# EAGLE schematic ME461_F28027 (EAGLE 7.7.0)

## Sheet 1 of 5
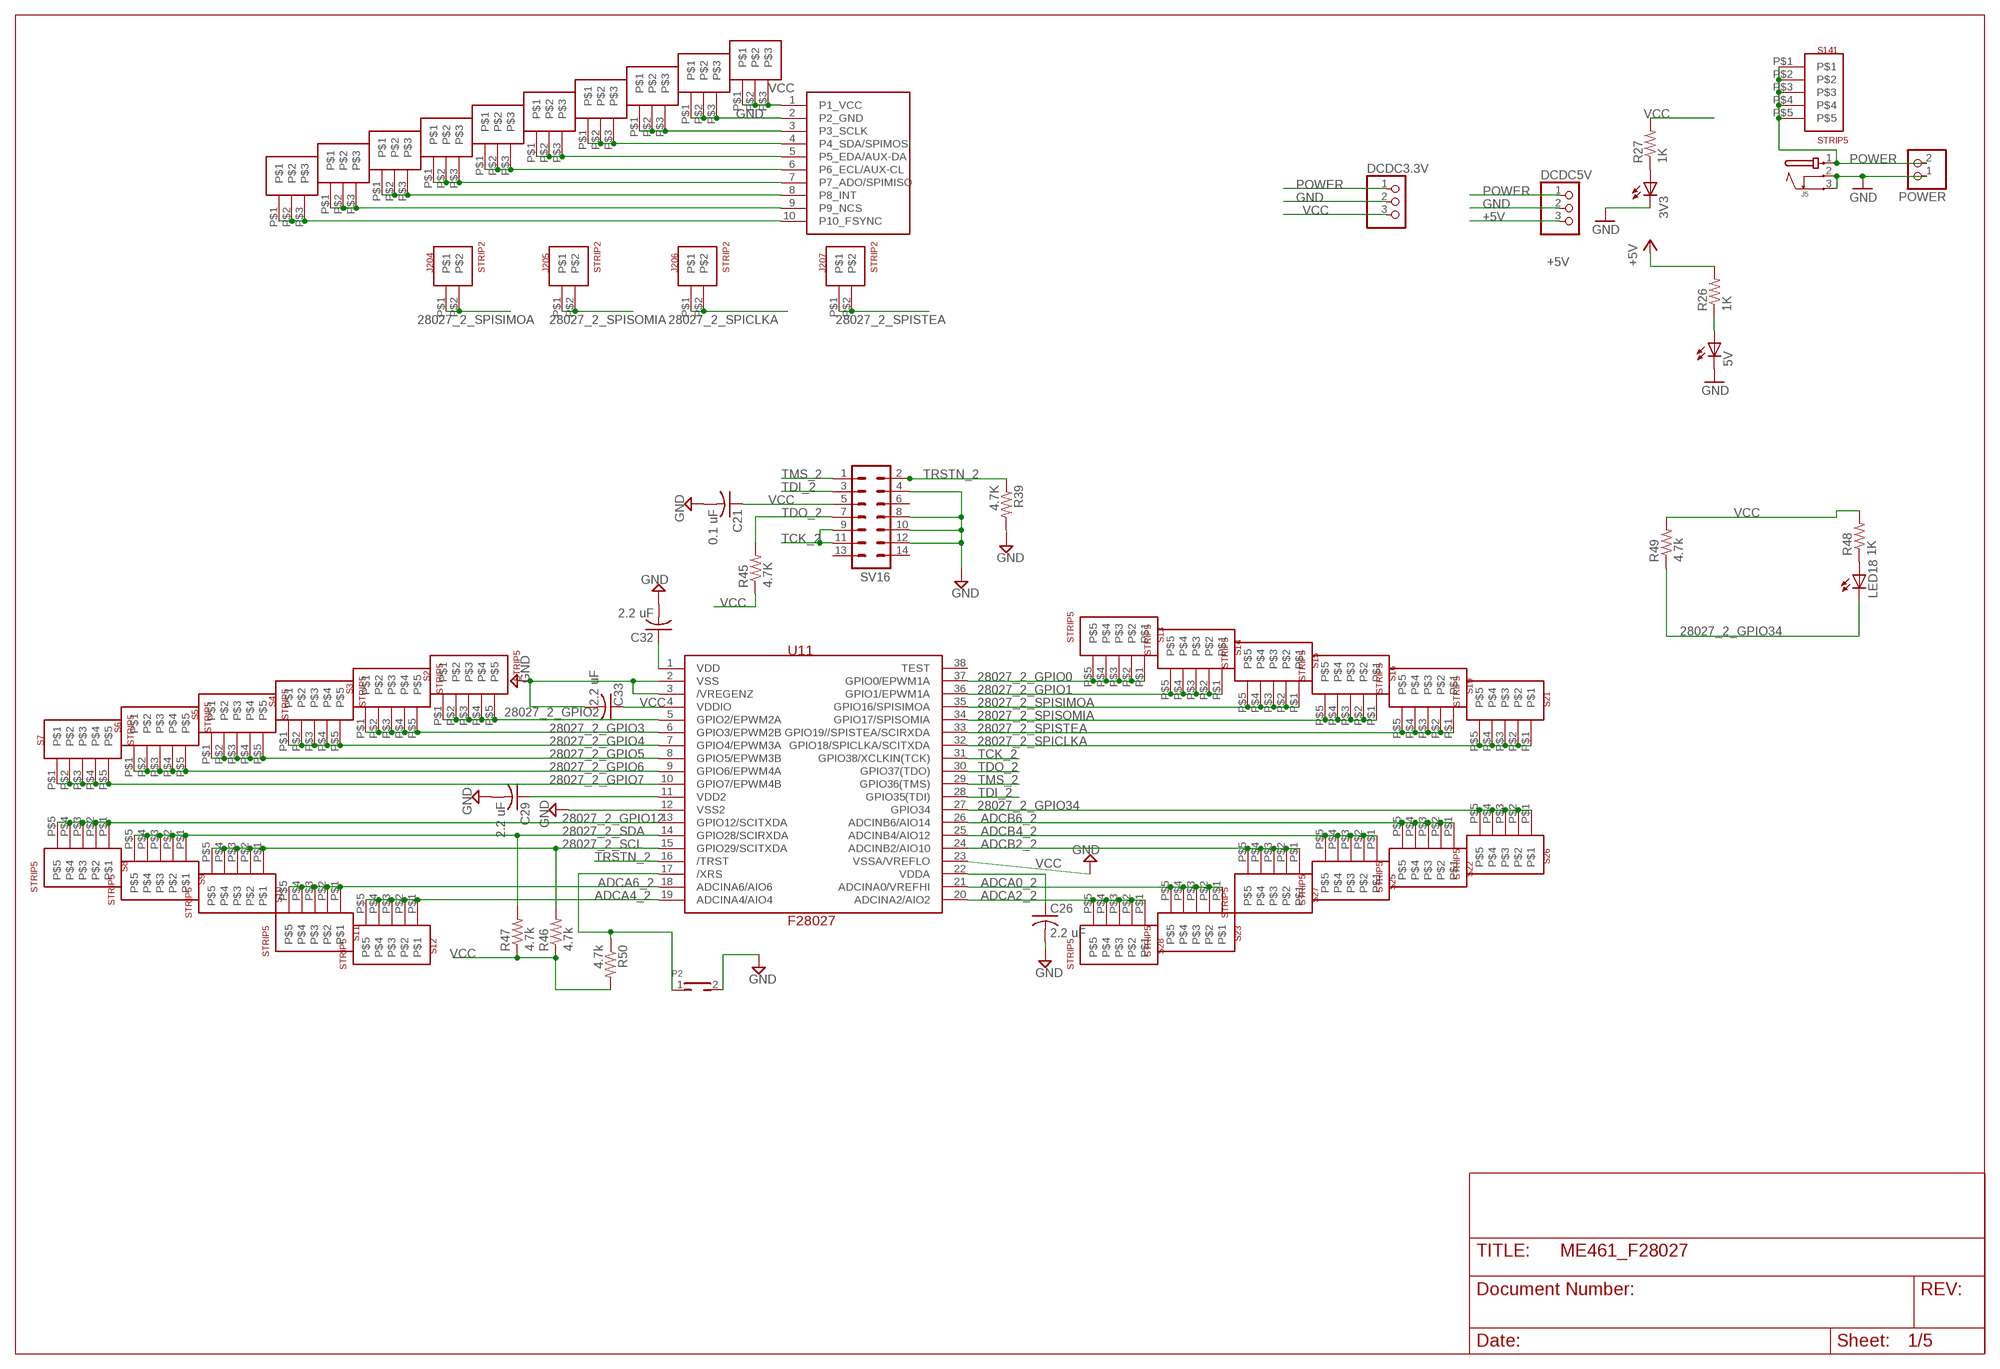
[diagram p0: schematic, sheet 1]

### Parts
3V3  LEDCHIPLED_1206  [CHIPLED_1206]
5V  LEDCHIPLED_1206  [CHIPLED_1206]
C21  0.1 uF  C-USC1206  [C1206]
C26  2.2 uF  C-USC1206  [C1206]
C29  2.2 uF  C-USC1206  [C1206]
C32  2.2 uF  C-USC1206  [C1206]
C33  2.2 uF  C-USC1206  [C1206]
DCDC3.3V  PINHD-1X3  [1X03]
DCDC5V  PINHD-1X3  [1X03]
J5  JACK-PMS  [JACK-PMS]
J123  STRIP3  [STRIP3]
J124  STRIP3  [STRIP3]
J125  STRIP3  [STRIP3]
J126  STRIP3  [STRIP3]
J127  STRIP3  [STRIP3]
J128  STRIP3  [STRIP3]
J129  STRIP3  [STRIP3]
J130  STRIP3  [STRIP3]
J131  STRIP3  [STRIP3]
J132  STRIP3  [STRIP3]
J204  STRIP2  [STRIP2]
J205  STRIP2  [STRIP2]
J206  STRIP2  [STRIP2]
J207  STRIP2  [STRIP2]
LED18  LEDCHIPLED_1206  [CHIPLED_1206]
P2  TH_PUSHBOTTON  [TH_PUSHBUTTON]
POWER  PINHD-1X2  [1X02]
R26  1K  R-US_M1206  [M1206]
R27  1K  R-US_M1206  [M1206]
R39  4.7K  R-US_M1206  [M1206]
R45  4.7K  R-US_M1206  [M1206]
R46  4.7k  R-US_M1206  [M1206]
R47  4.7k  R-US_M1206  [M1206]
R48  1K  R-US_M1206  [M1206]
R49  4.7k  R-US_M1206  [M1206]
R50  4.7k  R-US_M1206  [M1206]
S2  STRIP5  [STRIP5]
S3  STRIP5  [STRIP5]
S4  STRIP5  [STRIP5]
S5  STRIP5  [STRIP5]
S6  STRIP5  [STRIP5]
S7  STRIP5  [STRIP5]
S8  STRIP5  [STRIP5]
S9  STRIP5  [STRIP5]
S10  STRIP5  [STRIP5]
S11  STRIP5  [STRIP5]
S12  STRIP5  [STRIP5]
S13  STRIP5  [STRIP5]
S14  STRIP5  [STRIP5]
S15  STRIP5  [STRIP5]
S16  STRIP5  [STRIP5]
S19  STRIP5  [STRIP5]
S21  STRIP5  [STRIP5]
S22  STRIP5  [STRIP5]
S23  STRIP5  [STRIP5]
S25  STRIP5  [STRIP5]
S26  STRIP5  [STRIP5]
S27  STRIP5  [STRIP5]
S28  STRIP5  [STRIP5]
S141  STRIP5  [STRIP5]
SV16  MA07-2  [MA07-2]
U11  F28027  TMS320F28027DAS  [DA38]
U$1  MPU-9250-BB  [MPU-9250-BB]

### Nets
28027_2_GPIO0: S13.P$1 S13.P$2 S13.P$3 S13.P$4 S13.P$5 U11.37(GPIO0/EPWM1A) ; also sheet 3
28027_2_GPIO1: S14.P$1 S14.P$2 S14.P$3 S14.P$4 S14.P$5 U11.36(GPIO1/EPWM1A) ; also sheet 3
28027_2_GPIO2: S2.P$1 S2.P$2 S2.P$3 S2.P$4 S2.P$5 U11.5(GPIO2/EPWM2A) ; also sheet 3
28027_2_GPIO3: S3.P$1 S3.P$2 S3.P$3 S3.P$4 S3.P$5 U11.6(GPIO3/EPWM2B) ; also sheet 3
28027_2_GPIO4: S4.P$1 S4.P$2 S4.P$3 S4.P$4 S4.P$5 U11.7(GPIO4/EPWM3A) ; also sheet 3,4
28027_2_GPIO5: S5.P$1 S5.P$2 S5.P$3 S5.P$4 S5.P$5 U11.8(GPIO5/EPWM3B) ; also sheet 4
28027_2_GPIO6: S6.P$1 S6.P$2 S6.P$3 S6.P$4 S6.P$5 U11.9(GPIO6/EPWM4A) ; also sheet 3,4
28027_2_GPIO7: S7.P$1 S7.P$2 S7.P$3 S7.P$4 S7.P$5 U11.10(GPIO7/EPWM4B) ; also sheet 3
28027_2_GPIO12: S8.P$1 S8.P$2 S8.P$3 S8.P$4 S8.P$5 U11.13(GPIO12/SCITXDA) ; also sheet 3
28027_2_GPIO34: LED18.C R49.1 S26.P$1 S26.P$2 S26.P$3 S26.P$4 S26.P$5 U11.27(GPIO34) ; also sheet 4
28027_2_SCL: R46.2 S10.P$1 S10.P$2 S10.P$3 S10.P$4 S10.P$5 U11.15(GPIO29/SCITXDA) ; also sheet 4,5
28027_2_SDA: R47.2 S9.P$1 S9.P$2 S9.P$3 S9.P$4 S9.P$5 U11.14(GPIO28/SCIRXDA) ; also sheet 4,5
28027_2_SPICLKA: J206.P$1 J206.P$2 S21.P$1 S21.P$2 S21.P$3 S21.P$4 S21.P$5 U11.32(GPIO18/SPICLKA/SCITXDA) ; also sheet 2,4
28027_2_SPISIMOA: J204.P$1 J204.P$2 S15.P$1 S15.P$2 S15.P$3 S15.P$4 S15.P$5 U11.35(GPIO16/SPISIMOA) ; also sheet 2,4
28027_2_SPISOMIA: J205.P$1 J205.P$2 S16.P$1 S16.P$2 S16.P$3 S16.P$4 S16.P$5 U11.34(GPIO17/SPISOMIA) ; also sheet 2,4
28027_2_SPISTEA: J207.P$1 J207.P$2 S19.P$1 S19.P$2 S19.P$3 S19.P$4 S19.P$5 U11.33(GPIO19//SPISTEA/SCIRXDA)
+5V [supply]: DCDC5V.3 R26.2 ; also sheet 2,3,4,5
ADCA0_2: S23.P$1 S23.P$2 S23.P$3 S23.P$4 S23.P$5 U11.21(ADCINA0/VREFHI) ; also sheet 5
ADCA2_2: S28.P$1 S28.P$2 S28.P$3 S28.P$4 S28.P$5 U11.20(ADCINA2/AIO2) ; also sheet 5
ADCA4_2: S12.P$1 S12.P$2 S12.P$3 S12.P$4 S12.P$5 U11.19(ADCINA4/AIO4) ; also sheet 5
ADCA6_2: S11.P$1 S11.P$2 S11.P$3 S11.P$4 S11.P$5 U11.18(ADCINA6/AIO6) ; also sheet 5
ADCB2_2: S27.P$1 S27.P$2 S27.P$3 S27.P$4 S27.P$5 U11.24(ADCINB2/AIO10) ; also sheet 5
ADCB4_2: S25.P$1 S25.P$2 S25.P$3 S25.P$4 S25.P$5 U11.25(ADCINB4/AIO12) ; also sheet 4,5
ADCB6_2: S22.P$1 S22.P$2 S22.P$3 S22.P$4 S22.P$5 U11.26(ADCINB6/AIO14) ; also sheet 4
GND [supply]: 3V3.C 5V.C C21.2 C26.2 C29.2 C32.2 C33.2 DCDC3.3V.2 DCDC5V.2 J5.2 J5.3 J124.P$1 J124.P$2 J124.P$3 P2.2 POWER.1 R39.2 SV16.4 SV16.8 SV16.10 SV16.12 U11.2(VSS) U11.3(/VREGENZ) U11.12(VSS2) U11.23(VSSA/VREFLO) U$1.2(P2_GND) ; also sheet 2,3,4,5
N$2: 3V3.A R27.1
N$19: C32.1 U11.1(VDD)
N$20: C29.1 U11.11(VDD2)
N$21: P2.1 R50.1 U11.17(/XRS)
N$22: LED18.A R48.1
N$114: 5V.A R26.1
N$335 [supply]: J125.P$1 J125.P$2 J125.P$3 U$1.3(P3_SCLK)
N$336 [supply]: J126.P$1 J126.P$2 J126.P$3 U$1.4(P4_SDA/SPIMOSI)
N$337 [supply]: J127.P$1 J127.P$2 J127.P$3 U$1.5(P5_EDA/AUX-DA)
N$338 [supply]: J128.P$1 J128.P$2 J128.P$3 U$1.6(P6_ECL/AUX-CL)
N$339 [supply]: J129.P$1 J129.P$2 J129.P$3 U$1.7(P7_ADO/SPIMISO)
N$340 [supply]: J130.P$1 J130.P$2 J130.P$3 U$1.8(P8_INT)
N$341 [supply]: J131.P$1 J131.P$2 J131.P$3 U$1.9(P9_NCS)
N$342 [supply]: J132.P$1 J132.P$2 J132.P$3 U$1.10(P10_FSYNC)
POWER [supply]: DCDC3.3V.1 DCDC5V.1 J5.1 POWER.2 S141.P$1 S141.P$2 S141.P$3 S141.P$4 S141.P$5 ; also sheet 3,5
TCK_2: SV16.9 SV16.11 U11.31(GPIO38/XCLKIN(TCK))
TDI_2: SV16.3 U11.28(GPIO35(TDI))
TDO_2: R45.2 SV16.7 U11.30(GPIO37(TDO)) ; also sheet 5
TMS_2: SV16.1 U11.29(GPIO36(TMS))
TRSTN_2: R39.1 SV16.2 U11.16(/TRST)
VCC [supply]: C21.1 C26.1 C33.1 DCDC3.3V.3 J123.P$1 J123.P$2 J123.P$3 R27.2 R45.1 R46.1 R47.1 R48.2 R49.2 R50.2 SV16.5 U11.4(VDDIO) U11.22(VDDA) U$1.1(P1_VCC) ; also sheet 2,3,4,5
Unconnected: SV16.6 SV16.13 SV16.14 U11.38(TEST)

## Sheet 2 of 5
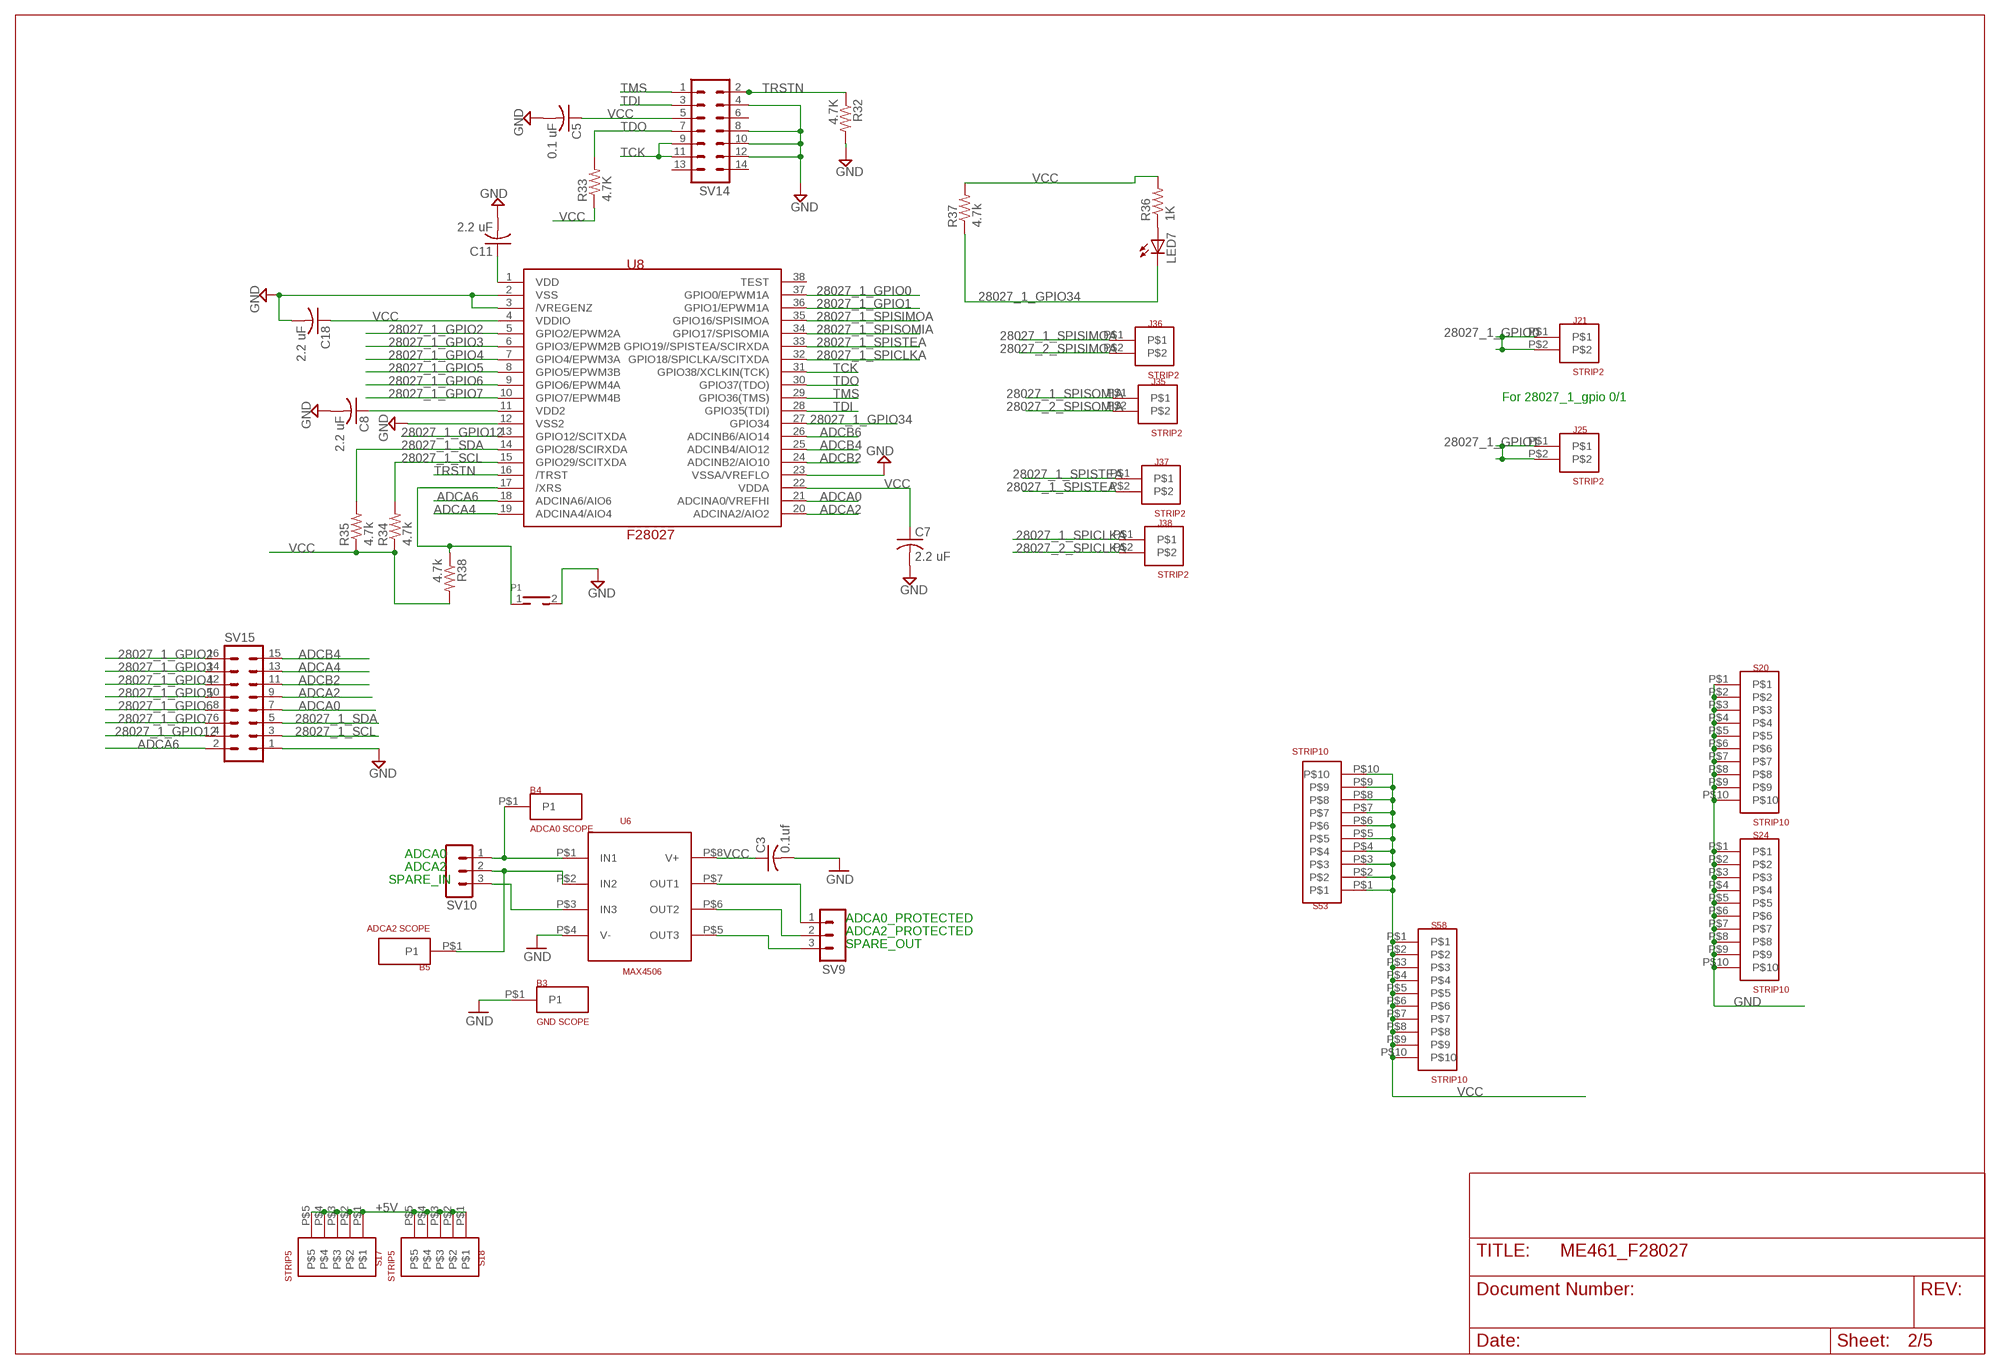
[diagram p1: schematic, sheet 2]

### Parts
B3  GND SCOPE  BANANA_MALE  [BANANA_MALE]
B4  ADCA0 SCOPE  BANANA_MALE  [BANANA_MALE]
B5  ADCA2 SCOPE  BANANA_MALE  [BANANA_MALE]
C3  0.1uf  C-USC1206  [C1206]
C5  0.1 uF  C-USC1206  [C1206]
C7  2.2 uF  C-USC1206  [C1206]
C8  2.2 uF  C-USC1206  [C1206]
C11  2.2 uF  C-USC1206  [C1206]
C18  2.2 uF  C-USC1206  [C1206]
J21  STRIP2  [STRIP2]
J25  STRIP2  [STRIP2]
J35  STRIP2  [STRIP2]
J36  STRIP2  [STRIP2]
J37  STRIP2  [STRIP2]
J38  STRIP2  [STRIP2]
LED7  LEDCHIPLED_1206  [CHIPLED_1206]
P1  TH_PUSHBOTTON  [TH_PUSHBUTTON]
R32  4.7K  R-US_M1206  [M1206]
R33  4.7K  R-US_M1206  [M1206]
R34  4.7k  R-US_M1206  [M1206]
R35  4.7k  R-US_M1206  [M1206]
R36  1K  R-US_M1206  [M1206]
R37  4.7k  R-US_M1206  [M1206]
R38  4.7k  R-US_M1206  [M1206]
S17  STRIP5  [STRIP5]
S18  STRIP5  [STRIP5]
S20  STRIP10  [STRIP10]
S24  STRIP10  [STRIP10]
S53  STRIP10  [STRIP10]
S58  STRIP10  [STRIP10]
SV9  MA03-1  [MA03-1]
SV10  MA03-1  [MA03-1]
SV14  MA07-2  [MA07-2]
SV15  MA08-2  [MA08-2]
U6  MAX4506  MAX4506-SOIC8  [SOIC-8]
U8  F28027  TMS320F28027DAS  [DA38]

### Nets
28027_1_GPIO0: J21.P$1 J21.P$2 U8.37(GPIO0/EPWM1A)
28027_1_GPIO1: J25.P$1 J25.P$2 U8.36(GPIO1/EPWM1A)
28027_1_GPIO2: SV15.16 U8.5(GPIO2/EPWM2A)
28027_1_GPIO3: SV15.14 U8.6(GPIO3/EPWM2B)
28027_1_GPIO4: SV15.12 U8.7(GPIO4/EPWM3A)
28027_1_GPIO5: SV15.10 U8.8(GPIO5/EPWM3B)
28027_1_GPIO6: SV15.8 U8.9(GPIO6/EPWM4A)
28027_1_GPIO7: SV15.6 U8.10(GPIO7/EPWM4B)
28027_1_GPIO12: SV15.4 U8.13(GPIO12/SCITXDA)
28027_1_GPIO34: LED7.C R37.1 U8.27(GPIO34)
28027_1_SCL: R34.2 SV15.3 U8.15(GPIO29/SCITXDA)
28027_1_SDA: R35.2 SV15.5 U8.14(GPIO28/SCIRXDA)
28027_1_SPICLKA: J38.P$1 U8.32(GPIO18/SPICLKA/SCITXDA)
28027_1_SPISIMOA: J36.P$1 U8.35(GPIO16/SPISIMOA)
28027_1_SPISOMIA: J35.P$1 U8.34(GPIO17/SPISOMIA)
28027_1_SPISTEA: J37.P$1 J37.P$2 U8.33(GPIO19//SPISTEA/SCIRXDA)
28027_2_SPICLKA: J38.P$2 ; also sheet 1,4
28027_2_SPISIMOA: J36.P$2 ; also sheet 1,4
28027_2_SPISOMIA: J35.P$2 ; also sheet 1,4
+5V [supply]: S17.P$1 S17.P$2 S17.P$3 S17.P$4 S17.P$5 S18.P$1 S18.P$2 S18.P$3 S18.P$4 S18.P$5 ; also sheet 1,3,4,5
ADCA0: SV15.7 U8.21(ADCINA0/VREFHI)
ADCA2: SV15.9 U8.20(ADCINA2/AIO2)
ADCA4: SV15.13 U8.19(ADCINA4/AIO4)
ADCA6: SV15.2 U8.18(ADCINA6/AIO6)
ADCB2: SV15.11 U8.24(ADCINB2/AIO10)
ADCB4: SV15.15 U8.25(ADCINB4/AIO12)
ADCB6: U8.26(ADCINB6/AIO14)
GND [supply]: B3.P$1(P1) C3.2 C5.2 C7.2 C8.2 C11.2 C18.2 P1.2 R32.2 S20.P$1 S20.P$2 S20.P$3 S20.P$4 S20.P$5 S20.P$6 S20.P$7 S20.P$8 S20.P$9 S20.P$10 S24.P$1 S24.P$2 S24.P$3 S24.P$4 S24.P$5 S24.P$6 S24.P$7 S24.P$8 S24.P$9 S24.P$10 SV14.4 SV14.8 SV14.10 SV14.12 SV15.1 U6.P$4(V-) U8.2(VSS) U8.3(/VREGENZ) U8.12(VSS2) U8.23(VSSA/VREFLO) ; also sheet 1,3,4,5
N$3: SV9.1 U6.P$7(OUT1)
N$4: SV9.2 U6.P$6(OUT2)
N$5: SV9.3 U6.P$5(OUT3)
N$6: B4.P$1(P1) SV10.1 U6.P$1(IN1)
N$8: SV10.3 U6.P$3(IN3)
N$14: C11.1 U8.1(VDD)
N$15: C8.1 U8.11(VDD2)
N$16: P1.1 R38.1 U8.17(/XRS)
N$18: LED7.A R36.1
N$26: B5.P$1(P1) SV10.2 U6.P$2(IN2)
TCK: SV14.9 SV14.11 U8.31(GPIO38/XCLKIN(TCK))
TDI: SV14.3 U8.28(GPIO35(TDI))
TDO: R33.2 SV14.7 U8.30(GPIO37(TDO))
TMS: SV14.1 U8.29(GPIO36(TMS))
TRSTN: R32.1 SV14.2 U8.16(/TRST)
VCC [supply]: C3.1 C5.1 C7.1 C18.1 R33.1 R34.1 R35.1 R36.2 R37.2 R38.2 S53.P$1 S53.P$2 S53.P$3 S53.P$4 S53.P$5 S53.P$6 S53.P$7 S53.P$8 S53.P$9 S53.P$10 S58.P$1 S58.P$2 S58.P$3 S58.P$4 S58.P$5 S58.P$6 S58.P$7 S58.P$8 S58.P$9 S58.P$10 SV14.5 U6.P$8(V+) U8.4(VDDIO) U8.22(VDDA) ; also sheet 1,3,4,5
Unconnected: SV14.6 SV14.13 SV14.14 U8.38(TEST)

### Notes on the sheet
- For 28027_1_gpio 0/1
- ADCA0
- ADCA2
- SPARE_IN
- ADCA0_PROTECTED
- ADCA2_PROTECTED
- SPARE_OUT

## Sheet 3 of 5
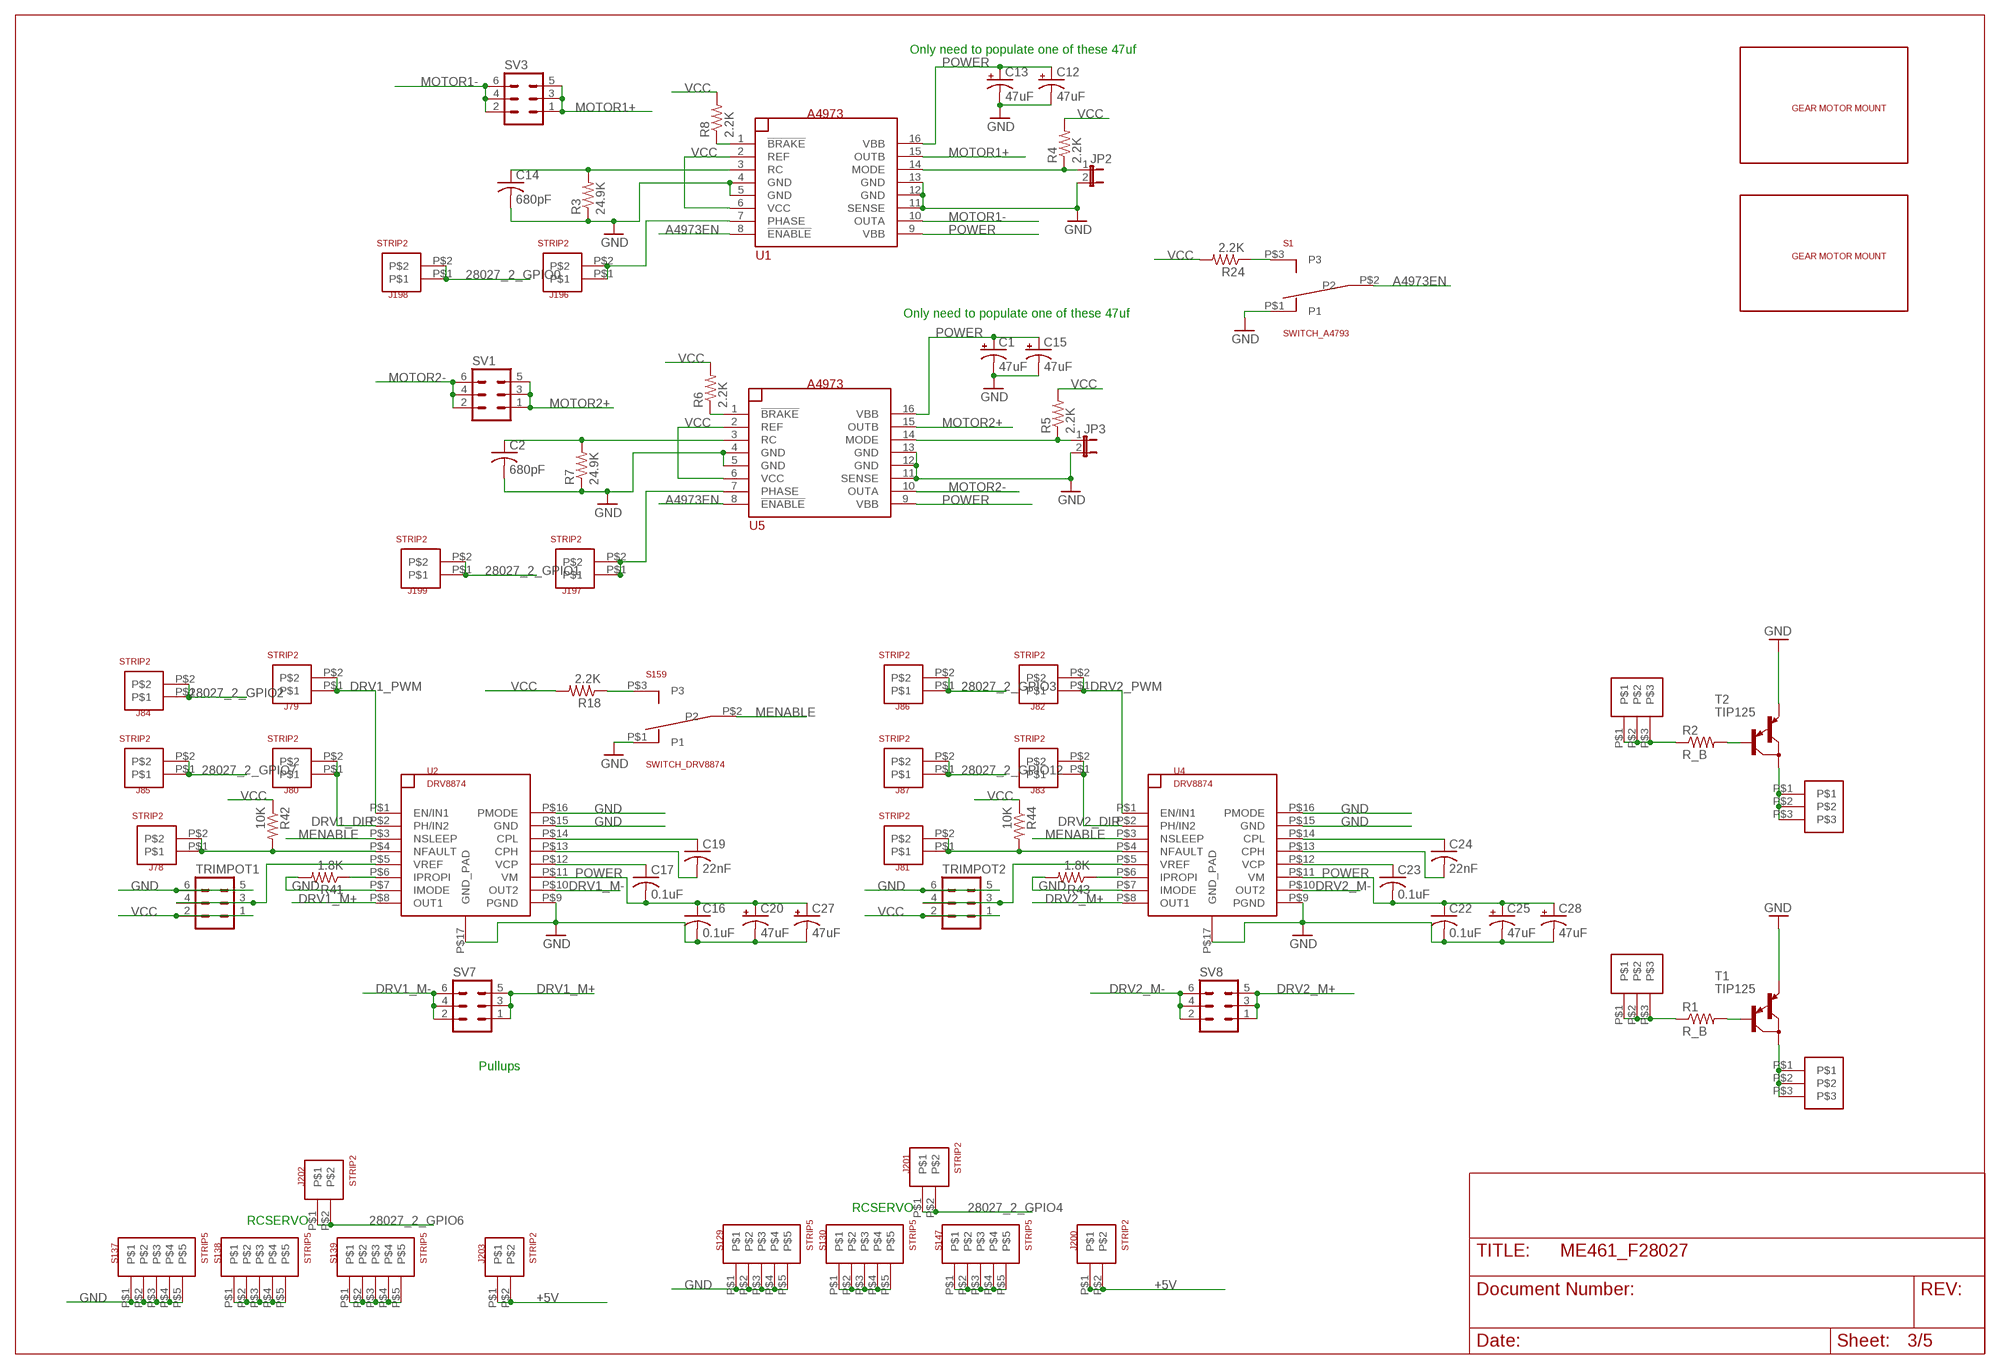
[diagram p2: schematic, sheet 3]

### Parts
C1  47uF  CPOL-US153CLV-0810  [153CLV-0810]
C2  680pF  C-USC1206  [C1206]
C12  47uF  CPOL-US153CLV-0810  [153CLV-0810]
C13  47uF  CPOL-US153CLV-0810  [153CLV-0810]
C14  680pF  C-USC1206  [C1206]
C15  47uF  CPOL-US153CLV-0810  [153CLV-0810]
C16  0.1uF  C-USC1206  [C1206]
C17  0.1uF  C-USC1206  [C1206]
C19  22nF  C-USC1206  [C1206]
C20  47uF  CPOL-US153CLV-0810  [153CLV-0810]
C22  0.1uF  C-USC1206  [C1206]
C23  0.1uF  C-USC1206  [C1206]
C24  22nF  C-USC1206  [C1206]
C25  47uF  CPOL-US153CLV-0810  [153CLV-0810]
C27  47uF  CPOL-US153CLV-0810  [153CLV-0810]
C28  47uF  CPOL-US153CLV-0810  [153CLV-0810]
J4  STRIP3  [STRIP3]
J6  STRIP3  [STRIP3]
J23  STRIP3  [STRIP3]
J24  STRIP3  [STRIP3]
J78  STRIP2  [STRIP2]
J79  STRIP2  [STRIP2]
J80  STRIP2  [STRIP2]
J81  STRIP2  [STRIP2]
J82  STRIP2  [STRIP2]
J83  STRIP2  [STRIP2]
J84  STRIP2  [STRIP2]
J85  STRIP2  [STRIP2]
J86  STRIP2  [STRIP2]
J87  STRIP2  [STRIP2]
J196  STRIP2  [STRIP2]
J197  STRIP2  [STRIP2]
J198  STRIP2  [STRIP2]
J199  STRIP2  [STRIP2]
J200  STRIP2  [STRIP2]
J201  STRIP2  [STRIP2]
J202  STRIP2  [STRIP2]
J203  STRIP2  [STRIP2]
JP2  JP1E  [JP1]
JP3  JP1E  [JP1]
R1  R_B  R-US_0207/10  [0207/10]
R2  R_B  R-US_0207/10  [0207/10]
R3  24.9K  R-US_M1206  [M1206]
R4  2.2K  R-US_M1206  [M1206]
R5  2.2K  R-US_M1206  [M1206]
R6  2.2K  R-US_M1206  [M1206]
R7  24.9K  R-US_M1206  [M1206]
R8  2.2K  R-US_M1206  [M1206]
R18  2.2K  R-US_M1206  [M1206]
R24  2.2K  R-US_M1206  [M1206]
R41  1.8K  R-US_M1206  [M1206]
R42  10K  R-US_M1206  [M1206]
R43  1.8K  R-US_M1206  [M1206]
R44  10K  R-US_M1206  [M1206]
S1  SWITCH_A4793  SWITCH_SLIDE  [SWITCH_SLIDE]
S129  STRIP5  [STRIP5]
S130  STRIP5  [STRIP5]
S137  STRIP5  [STRIP5]
S138  STRIP5  [STRIP5]
S139  STRIP5  [STRIP5]
S147  STRIP5  [STRIP5]
S159  SWITCH_DRV8874  SWITCH_SLIDE  [SWITCH_SLIDE]
SV1  MA03-2  [MA03-2]
SV3  MA03-2  [MA03-2]
SV7  MA03-2  [MA03-2]
SV8  MA03-2  [MA03-2]
T1  TIP125  [TO220]
T2  TIP125  [TO220]
TRIMPOT1  MA03-2  [MA03-2]
TRIMPOT2  MA03-2  [MA03-2]
U1  A4973  A3953  [SO16W]
U2  DRV8874  [HTSSOP16]
U4  DRV8874  [HTSSOP16]
U5  A4973  A3953  [SO16W]
U$2  GEARMOTOR_MOUNT  [GEARMOTOR_MOUNT]
U$3  GEARMOTOR_MOUNT  [GEARMOTOR_MOUNT]

### Nets
28027_2_GPIO0: J198.P$1 J198.P$2 ; also sheet 1
28027_2_GPIO1: J199.P$1 J199.P$2 ; also sheet 1
28027_2_GPIO2: J84.P$1 J84.P$2 ; also sheet 1
28027_2_GPIO3: J86.P$1 J86.P$2 ; also sheet 1
28027_2_GPIO4: J201.P$1 J201.P$2 ; also sheet 1,4
28027_2_GPIO6: J202.P$1 J202.P$2 ; also sheet 1,4
28027_2_GPIO7: J85.P$1 J85.P$2 ; also sheet 1
28027_2_GPIO12: J87.P$1 J87.P$2 ; also sheet 1
+5V [supply]: J200.P$1 J200.P$2 J203.P$1 J203.P$2 ; also sheet 1,2,4,5
A4973EN: S1.P$2(P2) U1.8(!ENABLE) U5.8(!ENABLE)
DRV1_DIR: J80.P$1 J80.P$2 U2.P$2(PH/IN2)
DRV1_M+: SV7.1 SV7.3 SV7.5 U2.P$8(OUT1)
DRV1_M-: SV7.2 SV7.4 SV7.6 U2.P$10(OUT2)
DRV1_PWM: J79.P$1 J79.P$2 U2.P$1(EN/IN1)
DRV2_DIR: J83.P$1 J83.P$2 U4.P$2(PH/IN2)
DRV2_M+: SV8.1 SV8.3 SV8.5 U4.P$8(OUT1)
DRV2_M-: SV8.2 SV8.4 SV8.6 U4.P$10(OUT2)
DRV2_PWM: J82.P$1 J82.P$2 U4.P$1(EN/IN1)
GND [supply]: C1.- C2.2 C12.- C13.- C14.2 C15.- C16.2 C20.- C22.2 C25.- C27.- C28.- JP2.2 JP3.2 R3.1 R7.1 R41.2 R43.2 S1.P$1(P1) S129.P$1 S129.P$2 S129.P$3 S129.P$4 S129.P$5 S137.P$1 S137.P$2 S137.P$3 S137.P$4 S137.P$5 S159.P$1(P1) T1.3(E) T2.3(E) TRIMPOT1.5 TRIMPOT1.6 TRIMPOT2.5 TRIMPOT2.6 U1.4(GND) U1.5(GND) U1.11(SENSE) U1.12(GND) U1.13(GND) U2.P$7(IMODE) U2.P$9(PGND) U2.P$15(GND) U2.P$16(PMODE) U2.P$17(GND_PAD) U4.P$7(IMODE) U4.P$9(PGND) U4.P$15(GND) U4.P$16(PMODE) U4.P$17(GND_PAD) U5.4(GND) U5.5(GND) U5.11(SENSE) U5.12(GND) U5.13(GND) ; also sheet 1,2,4,5
MENABLE: S159.P$2(P2) U2.P$3(NSLEEP) U4.P$3(NSLEEP)
MOTOR1+ [supply]: SV3.1 SV3.3 SV3.5 U1.15(OUTB)
MOTOR1- [supply]: SV3.2 SV3.4 SV3.6 U1.10(OUTA)
MOTOR2+ [supply]: SV1.1 SV1.3 SV1.5 U5.15(OUTB)
MOTOR2- [supply]: SV1.2 SV1.4 SV1.6 U5.10(OUTA)
N$1: R24.1 S1.P$3(P3)
N$9 [supply]: S139.P$1 S139.P$2 S139.P$3 S139.P$4 S139.P$5
N$10 [supply]: S147.P$1 S147.P$2 S147.P$3 S147.P$4 S147.P$5
N$31: R2.2 T2.1(B)
N$87: R1.2 T1.1(B)
N$88 [supply]: S138.P$1 S138.P$2 S138.P$3 S138.P$4 S138.P$5
N$125: R6.1 U5.1(!BRAKE)
N$127: C2.1 R7.2 U5.3(RC)
N$129: R8.1 U1.1(!BRAKE)
N$130: C14.1 R3.2 U1.3(RC)
N$131: JP2.1 R4.1 U1.14(MODE)
N$132: R18.1 S159.P$3(P3)
N$133: JP3.1 R5.1 U5.14(MODE)
N$175: C19.1 U2.P$14(CPL)
N$176: C19.2 U2.P$13(CPH)
N$177: C17.1 U2.P$12(VCP)
N$178: R43.1 U4.P$6(IPROPI)
N$179: R41.1 U2.P$6(IPROPI)
N$186: J78.P$1 J78.P$2 R42.2 U2.P$4(NFAULT)
N$187: TRIMPOT1.3 TRIMPOT1.4 U2.P$5(VREF)
N$188: C24.1 U4.P$14(CPL)
N$189: C24.2 U4.P$13(CPH)
N$190: C23.1 U4.P$12(VCP)
N$191: J81.P$1 J81.P$2 R44.2 U4.P$4(NFAULT)
N$192: TRIMPOT2.3 TRIMPOT2.4 U4.P$5(VREF)
N$407 [supply]: S130.P$1 S130.P$2 S130.P$3 S130.P$4 S130.P$5
N$414: J196.P$1 J196.P$2 U1.7(PHASE)
N$425: J197.P$1 J197.P$2 U5.7(PHASE)
POWER [supply]: C1.+ C12.+ C13.+ C15.+ C16.1 C17.2 C20.+ C22.1 C23.2 C25.+ C27.+ C28.+ U1.9(VBB) U1.16(VBB) U2.P$11(VM) U4.P$11(VM) U5.9(VBB) U5.16(VBB) ; also sheet 1,5
TR_BASE: J6.P$1 J6.P$2 J6.P$3 R1.1
TR_BASE1: J24.P$1 J24.P$2 J24.P$3 R2.1
TR_LOAD: J4.P$1 J4.P$2 J4.P$3 T1.2(C)
TR_LOAD1: J23.P$1 J23.P$2 J23.P$3 T2.2(C)
VCC [supply]: R4.2 R5.2 R6.2 R8.2 R18.2 R24.2 R42.1 R44.1 TRIMPOT1.1 TRIMPOT1.2 TRIMPOT2.1 TRIMPOT2.2 U1.2(REF) U1.6(VCC) U5.2(REF) U5.6(VCC) ; also sheet 1,2,4,5

### Notes on the sheet
- Only need to populate one of these 47uf
- Only need to populate one of these 47uf
- Pullups
- RCSERVO
- RCSERVO

## Sheet 4 of 5
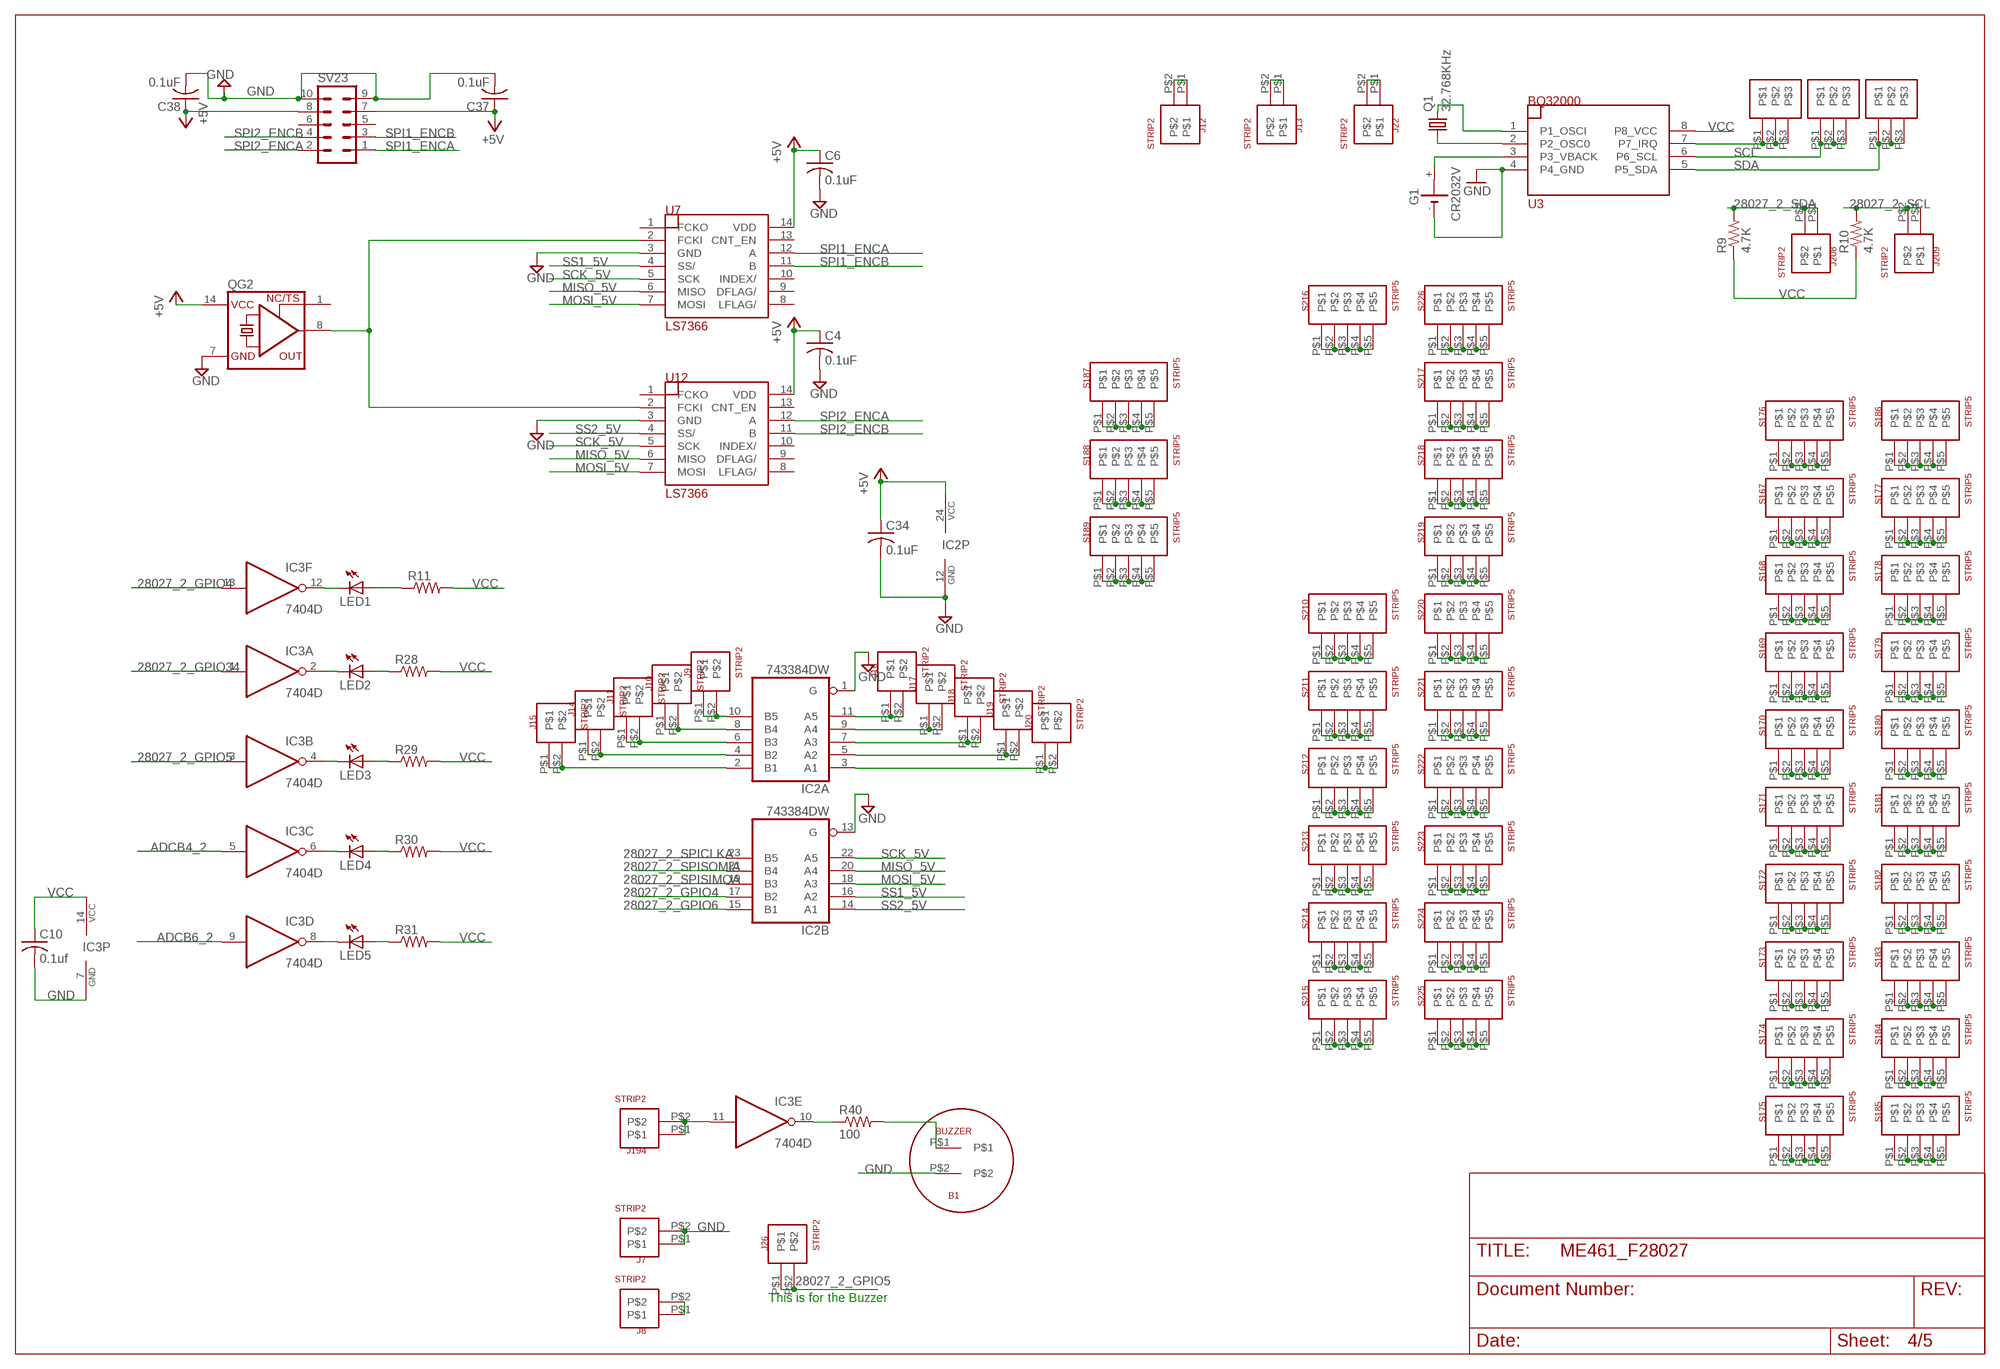
[diagram p3: schematic, sheet 4]

### Parts
B1  BUZZER  [BUZZER]
C4  0.1uF  C-USC1206  [C1206]
C6  0.1uF  C-USC1206  [C1206]
C10  0.1uf  C-USC1206  [C1206]
C34  0.1uF  C-USC1206  [C1206]
C37  0.1uF  C-USC1206  [C1206]
C38  0.1uF  C-USC1206  [C1206]
G1  CR2032V  [CR2032V]
IC2  743384DW  [SO24W]
IC3  7404D  [SO14]
J1  STRIP3  [STRIP3]
J2  STRIP3  [STRIP3]
J3  STRIP3  [STRIP3]
J7  STRIP2  [STRIP2]
J8  STRIP2  [STRIP2]
J9  STRIP2  [STRIP2]
J10  STRIP2  [STRIP2]
J11  STRIP2  [STRIP2]
J12  STRIP2  [STRIP2]
J13  STRIP2  [STRIP2]
J14  STRIP2  [STRIP2]
J15  STRIP2  [STRIP2]
J16  STRIP2  [STRIP2]
J17  STRIP2  [STRIP2]
J18  STRIP2  [STRIP2]
J19  STRIP2  [STRIP2]
J20  STRIP2  [STRIP2]
J22  STRIP2  [STRIP2]
J26  STRIP2  [STRIP2]
J194  STRIP2  [STRIP2]
J208  STRIP2  [STRIP2]
J209  STRIP2  [STRIP2]
LED1  LEDCHIPLED_1206  [CHIPLED_1206]
LED2  LEDCHIPLED_1206  [CHIPLED_1206]
LED3  LEDCHIPLED_1206  [CHIPLED_1206]
LED4  LEDCHIPLED_1206  [CHIPLED_1206]
LED5  LEDCHIPLED_1206  [CHIPLED_1206]
Q1  32.768KHz  CRYTALTC26H  [TC26H]
QG2  XO-14  [DIL14S]
R9  4.7K  R-US_R1206  [R1206]
R10  4.7K  R-US_R1206  [R1206]
R11  R-US_R1206  [R1206]
R28  R-US_R1206  [R1206]
R29  R-US_R1206  [R1206]
R30  R-US_R1206  [R1206]
R31  R-US_R1206  [R1206]
R40  100  R-US_R1206  [R1206]
S167  STRIP5  [STRIP5]
S168  STRIP5  [STRIP5]
S169  STRIP5  [STRIP5]
S170  STRIP5  [STRIP5]
S171  STRIP5  [STRIP5]
S172  STRIP5  [STRIP5]
S173  STRIP5  [STRIP5]
S174  STRIP5  [STRIP5]
S175  STRIP5  [STRIP5]
S176  STRIP5  [STRIP5]
S177  STRIP5  [STRIP5]
S178  STRIP5  [STRIP5]
S179  STRIP5  [STRIP5]
S180  STRIP5  [STRIP5]
S181  STRIP5  [STRIP5]
S182  STRIP5  [STRIP5]
S183  STRIP5  [STRIP5]
S184  STRIP5  [STRIP5]
S185  STRIP5  [STRIP5]
S186  STRIP5  [STRIP5]
S187  STRIP5  [STRIP5]
S188  STRIP5  [STRIP5]
S189  STRIP5  [STRIP5]
S210  STRIP5  [STRIP5]
S211  STRIP5  [STRIP5]
S212  STRIP5  [STRIP5]
S213  STRIP5  [STRIP5]
S214  STRIP5  [STRIP5]
S215  STRIP5  [STRIP5]
S216  STRIP5  [STRIP5]
S217  STRIP5  [STRIP5]
S218  STRIP5  [STRIP5]
S219  STRIP5  [STRIP5]
S220  STRIP5  [STRIP5]
S221  STRIP5  [STRIP5]
S222  STRIP5  [STRIP5]
S223  STRIP5  [STRIP5]
S224  STRIP5  [STRIP5]
S225  STRIP5  [STRIP5]
S226  STRIP5  [STRIP5]
SV23  MA05-2  [MA05-2]
U3  BQ32000  [SO08]
U7  LS7366  LS7366R  [SO14]
U12  LS7366  LS7366R  [SO14]

### Nets
28027_2_GPIO4: IC2.17(B:B2) IC3.13(F:I) ; also sheet 1,3
28027_2_GPIO5: IC3.3(B:I) J26.P$1 J26.P$2 ; also sheet 1
28027_2_GPIO6: IC2.15(B:B1) ; also sheet 1,3
28027_2_GPIO34: IC3.1(A:I) ; also sheet 1
28027_2_SCL: J209.P$1 J209.P$2 R10.2 ; also sheet 1,5
28027_2_SDA: J208.P$1 J208.P$2 R9.2 ; also sheet 1,5
28027_2_SPICLKA: IC2.23(B:B5) ; also sheet 1,2
28027_2_SPISIMOA: IC2.19(B:B3) ; also sheet 1,2
28027_2_SPISOMIA: IC2.21(B:B4) ; also sheet 1,2
+5V [supply]: C4.1 C6.1 C34.1 C37.1 C38.1 IC2.24(P:VCC) QG2.14(VCC) SV23.7 SV23.8 U7.14(VDD) U12.14(VDD) ; also sheet 1,2,3,5
A1: IC2.3(A:A1) J20.P$1 J20.P$2
A2: IC2.5(A:A2) J19.P$1 J19.P$2
A3: IC2.7(A:A3) J18.P$1 J18.P$2
A4: IC2.9(A:A4) J17.P$1 J17.P$2
A5: IC2.11(A:A5) J16.P$1 J16.P$2
ADCB4_2: IC3.5(C:I) ; also sheet 1,5
ADCB6_2: IC3.9(D:I) ; also sheet 1
B1: IC2.2(A:B1) J15.P$1 J15.P$2
B2: IC2.4(A:B2) J14.P$1 J14.P$2
B3: IC2.6(A:B3) J11.P$1 J11.P$2
B4: IC2.8(A:B4) J10.P$1 J10.P$2
B5: IC2.10(A:B5) J9.P$1 J9.P$2
GND [supply]: B1.P$2 C4.2 C6.2 C10.2 C34.2 C37.2 C38.2 G1.- IC2.1(A:G) IC2.12(P:GND) IC2.13(B:G) IC3.7(P:GND) J7.P$1 J7.P$2 QG2.7(GND) SV23.9 SV23.10 U3.4(P4_GND) U7.3(GND) U12.3(GND) ; also sheet 1,2,3,5
MISO_5V: IC2.20(B:A4) U7.6(MISO) U12.6(MISO)
MOSI_5V: IC2.18(B:A3) U7.7(MOSI) U12.7(MOSI)
N$11 [supply]: J12.P$1 J12.P$2
N$12 [supply]: J13.P$1 J13.P$2
N$13 [supply]: J22.P$1 J22.P$2
N$17: QG2.8(OUT) U7.2(FCKI) U12.2(FCKI)
N$23: IC3.12(F:O) LED1.C
N$24: LED1.A R11.1
N$46: J8.P$1 J8.P$2
N$48: IC3.10(E:O) R40.1
N$50: B1.P$1 R40.2
N$51: Q1.1 U3.2(P2_OSC0)
N$70: Q1.2 U3.1(P1_OSCI)
N$118: J1.P$1 J1.P$2 J1.P$3 U3.7(P7_IRQ)
N$119: G1.+ U3.3(P3_VBACK)
N$268 [supply]: S167.P$1 S167.P$2 S167.P$3 S167.P$4 S167.P$5
N$269 [supply]: S168.P$1 S168.P$2 S168.P$3 S168.P$4 S168.P$5
N$270 [supply]: S169.P$1 S169.P$2 S169.P$3 S169.P$4 S169.P$5
N$271 [supply]: S170.P$1 S170.P$2 S170.P$3 S170.P$4 S170.P$5
N$272 [supply]: S171.P$1 S171.P$2 S171.P$3 S171.P$4 S171.P$5
N$273 [supply]: S172.P$1 S172.P$2 S172.P$3 S172.P$4 S172.P$5
N$274 [supply]: S173.P$1 S173.P$2 S173.P$3 S173.P$4 S173.P$5
N$275 [supply]: S174.P$1 S174.P$2 S174.P$3 S174.P$4 S174.P$5
N$276 [supply]: S175.P$1 S175.P$2 S175.P$3 S175.P$4 S175.P$5
N$277 [supply]: S176.P$1 S176.P$2 S176.P$3 S176.P$4 S176.P$5
N$278 [supply]: S177.P$1 S177.P$2 S177.P$3 S177.P$4 S177.P$5
N$279 [supply]: S178.P$1 S178.P$2 S178.P$3 S178.P$4 S178.P$5
N$280 [supply]: S179.P$1 S179.P$2 S179.P$3 S179.P$4 S179.P$5
N$281 [supply]: S180.P$1 S180.P$2 S180.P$3 S180.P$4 S180.P$5
N$282 [supply]: S181.P$1 S181.P$2 S181.P$3 S181.P$4 S181.P$5
N$283 [supply]: S182.P$1 S182.P$2 S182.P$3 S182.P$4 S182.P$5
N$284 [supply]: S183.P$1 S183.P$2 S183.P$3 S183.P$4 S183.P$5
N$285 [supply]: S184.P$1 S184.P$2 S184.P$3 S184.P$4 S184.P$5
N$286 [supply]: S185.P$1 S185.P$2 S185.P$3 S185.P$4 S185.P$5
N$287 [supply]: S186.P$1 S186.P$2 S186.P$3 S186.P$4 S186.P$5
N$288 [supply]: S187.P$1 S187.P$2 S187.P$3 S187.P$4 S187.P$5
N$289 [supply]: S188.P$1 S188.P$2 S188.P$3 S188.P$4 S188.P$5
N$290 [supply]: S189.P$1 S189.P$2 S189.P$3 S189.P$4 S189.P$5
N$311 [supply]: S210.P$1 S210.P$2 S210.P$3 S210.P$4 S210.P$5
N$312 [supply]: S211.P$1 S211.P$2 S211.P$3 S211.P$4 S211.P$5
N$313 [supply]: S212.P$1 S212.P$2 S212.P$3 S212.P$4 S212.P$5
N$314 [supply]: S213.P$1 S213.P$2 S213.P$3 S213.P$4 S213.P$5
N$315 [supply]: S214.P$1 S214.P$2 S214.P$3 S214.P$4 S214.P$5
N$316 [supply]: S215.P$1 S215.P$2 S215.P$3 S215.P$4 S215.P$5
N$317 [supply]: S216.P$1 S216.P$2 S216.P$3 S216.P$4 S216.P$5
N$318 [supply]: S217.P$1 S217.P$2 S217.P$3 S217.P$4 S217.P$5
N$319 [supply]: S218.P$1 S218.P$2 S218.P$3 S218.P$4 S218.P$5
N$320 [supply]: S219.P$1 S219.P$2 S219.P$3 S219.P$4 S219.P$5
N$321 [supply]: S220.P$1 S220.P$2 S220.P$3 S220.P$4 S220.P$5
N$322 [supply]: S221.P$1 S221.P$2 S221.P$3 S221.P$4 S221.P$5
N$323 [supply]: S222.P$1 S222.P$2 S222.P$3 S222.P$4 S222.P$5
N$324 [supply]: S223.P$1 S223.P$2 S223.P$3 S223.P$4 S223.P$5
N$325 [supply]: S224.P$1 S224.P$2 S224.P$3 S224.P$4 S224.P$5
N$326 [supply]: S225.P$1 S225.P$2 S225.P$3 S225.P$4 S225.P$5
N$327 [supply]: S226.P$1 S226.P$2 S226.P$3 S226.P$4 S226.P$5
N$372: IC3.2(A:O) LED2.C
N$373: LED2.A R28.1
N$375: IC3.4(B:O) LED3.C
N$376: LED3.A R29.1
N$378: IC3.6(C:O) LED4.C
N$379: LED4.A R30.1
N$381: IC3.8(D:O) LED5.C
N$382: LED5.A R31.1
N$404: IC3.11(E:I) J194.P$1 J194.P$2
SCK_5V: IC2.22(B:A5) U7.5(SCK) U12.5(SCK)
SCL: J2.P$1 J2.P$2 J2.P$3 U3.6(P6_SCL)
SDA: J3.P$1 J3.P$2 J3.P$3 U3.5(P5_SDA)
SPI1_ENCA: SV23.1 U7.12(A)
SPI1_ENCB: SV23.3 U7.11(B)
SPI2_ENCA: SV23.2 U12.12(A)
SPI2_ENCB: SV23.4 U12.11(B)
SS1_5V: IC2.16(B:A2) U7.4(SS/)
SS2_5V: IC2.14(B:A1) U12.4(SS/)
VCC [supply]: C10.1 IC3.14(P:VCC) R9.1 R10.1 R11.2 R28.2 R29.2 R30.2 R31.2 U3.8(P8_VCC) ; also sheet 1,2,3,5
Unconnected: G1.+@1(+) QG2.1(TS) SV23.5 SV23.6 U7.1(FCKO) U7.8(LFLAG/) U7.9(DFLAG/) U7.10(INDEX/) U7.13(CNT_EN) U12.1(FCKO) U12.8(LFLAG/) U12.9(DFLAG/) U12.10(INDEX/) U12.13(CNT_EN)

### Notes on the sheet
- This is for the Buzzer

## Sheet 5 of 5
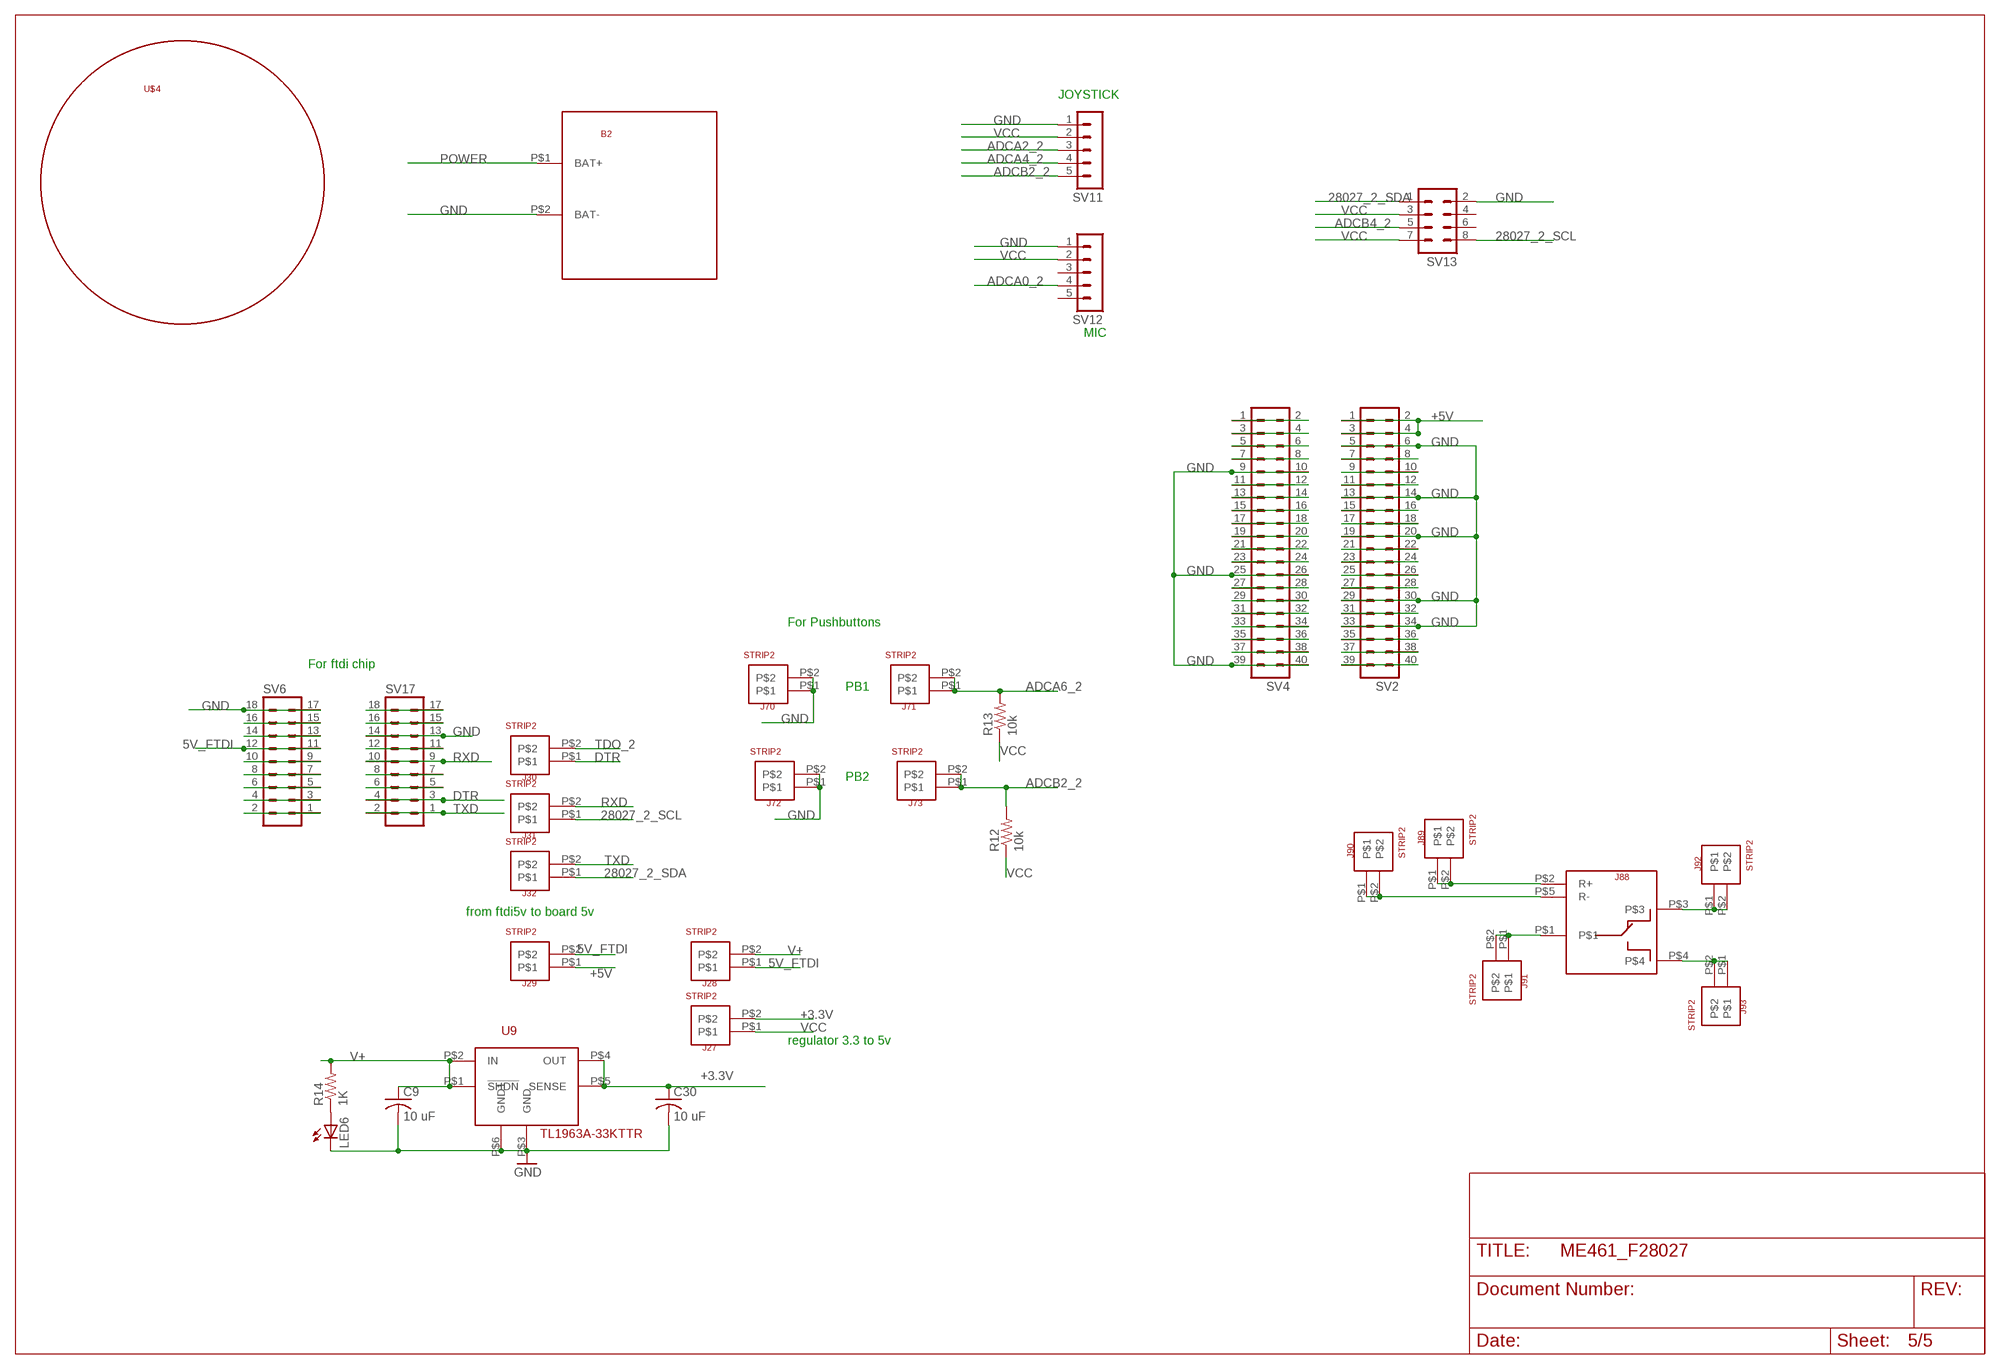
[diagram p4: schematic, sheet 5]

### Parts
B2  BATTERY_4AA_HOLDER  [BATTERY_4AA_HOLDER]
C9  10 uF  C-USC1206  [C1206]
C30  10 uF  C-USC1206  [C1206]
J27  STRIP2  [STRIP2]
J28  STRIP2  [STRIP2]
J29  STRIP2  [STRIP2]
J30  STRIP2  [STRIP2]
J31  STRIP2  [STRIP2]
J32  STRIP2  [STRIP2]
J70  STRIP2  [STRIP2]
J71  STRIP2  [STRIP2]
J72  STRIP2  [STRIP2]
J73  STRIP2  [STRIP2]
J88  RELAY_JQC-3F_5V  [RELAY_JQC-3F_5V]
J89  STRIP2  [STRIP2]
J90  STRIP2  [STRIP2]
J91  STRIP2  [STRIP2]
J92  STRIP2  [STRIP2]
J93  STRIP2  [STRIP2]
LED6  LEDCHIPLED_1206  [CHIPLED_1206]
R12  10k  R-US_R1206  [R1206]
R13  10k  R-US_R1206  [R1206]
R14  1K  R-US_M1206  [M1206]
SV2  MA20-2  [MA20-2]
SV4  MA20-2  [MA20-2]
SV6  MA09-2  [MA09-2]
SV11  MA05-1  [MA05-1]
SV12  MA05-1  [MA05-1]
SV13  MA04-2  [MA04-2]
SV17  MA09-2  [MA09-2]
U9  TL1963A-33KTTR  [TL1963AKTTR]
U$4  CASTERWHEEL  [CASTERWHEEL]

### Nets
5V_FTDI [supply]: J28.P$1 J29.P$2 SV6.11 SV6.12
28027_2_SCL: J31.P$1 SV13.8 ; also sheet 1,4
28027_2_SDA: J32.P$1 SV13.1 ; also sheet 1,4
+3.3V [supply]: C30.1 J27.P$2 U9.P$4(OUT) U9.P$5(SENSE)
+5V [supply]: J29.P$1 SV2.1 SV2.2 SV2.3 SV2.4 ; also sheet 1,2,3,4
ADCA0_2: SV12.4 ; also sheet 1
ADCA2_2: SV11.3 ; also sheet 1
ADCA4_2: SV11.4 ; also sheet 1
ADCA6_2: J71.P$1 J71.P$2 R13.2 ; also sheet 1
ADCB2_2: J73.P$1 J73.P$2 R12.2 SV11.5 ; also sheet 1
ADCB4_2: SV13.5 ; also sheet 1,4
DTR: J30.P$1 SV17.3 SV17.4
GND [supply]: B2.P$2(BAT-) C9.2 C30.2 J70.P$1 J70.P$2 J72.P$1 J72.P$2 LED6.C SV2.5 SV2.6 SV2.13 SV2.14 SV2.19 SV2.20 SV2.29 SV2.30 SV2.33 SV2.34 SV4.9 SV4.10 SV4.25 SV4.26 SV4.39 SV4.40 SV6.17 SV6.18 SV11.1 SV12.1 SV13.2 SV17.13 SV17.14 U9.P$3(GND) U9.P$6(GND1) ; also sheet 1,2,3,4
N$27: SV6.15 SV6.16
N$28: SV6.13 SV6.14
N$30: SV6.9 SV6.10
N$32: SV6.7 SV6.8
N$33: SV6.5 SV6.6
N$34: SV6.3 SV6.4
N$35: SV6.1 SV6.2
N$38: SV17.5 SV17.6
N$39: SV17.7 SV17.8
N$41: SV17.11 SV17.12
N$43: SV17.15 SV17.16
N$44: SV17.17 SV17.18
N$49 [supply]: SV4.1 SV4.2
N$57: LED6.A R14.1
N$71 [supply]: SV4.3 SV4.4
N$72 [supply]: SV4.5 SV4.6
N$73 [supply]: SV4.7 SV4.8
N$75 [supply]: SV4.11 SV4.12
N$76 [supply]: SV4.13 SV4.14
N$77 [supply]: SV4.15 SV4.16
N$78 [supply]: SV4.17 SV4.18
N$79 [supply]: SV4.19 SV4.20
N$80 [supply]: SV4.21 SV4.22
N$120 [supply]: SV4.23 SV4.24
N$122 [supply]: SV4.27 SV4.28
N$123 [supply]: SV4.29 SV4.30
N$124 [supply]: SV4.31 SV4.32
N$126 [supply]: SV4.33 SV4.34
N$128 [supply]: SV4.35 SV4.36
N$134 [supply]: SV4.37 SV4.38
N$136 [supply]: SV2.39 SV2.40
N$137 [supply]: SV2.37 SV2.38
N$138 [supply]: SV2.35 SV2.36
N$140 [supply]: SV2.31 SV2.32
N$142 [supply]: SV2.27 SV2.28
N$143 [supply]: SV2.25 SV2.26
N$144 [supply]: SV2.23 SV2.24
N$145 [supply]: SV2.21 SV2.22
N$147 [supply]: SV2.17 SV2.18
N$148 [supply]: SV2.15 SV2.16
N$150 [supply]: SV2.11 SV2.12
N$151 [supply]: SV2.9 SV2.10
N$152 [supply]: SV2.7 SV2.8
N$193 [supply]: J88.P$2(R+) J89.P$1 J89.P$2
N$194 [supply]: J88.P$5(R-) J90.P$1 J90.P$2
N$195 [supply]: J88.P$1 J91.P$1 J91.P$2
N$196 [supply]: J88.P$3 J92.P$1 J92.P$2
N$197 [supply]: J88.P$4 J93.P$1 J93.P$2
POWER [supply]: B2.P$1(BAT+) ; also sheet 1,3
RXD: J31.P$2 SV17.9 SV17.10
TDO_2: J30.P$2 ; also sheet 1
TXD: J32.P$2 SV17.1 SV17.2
V+ [supply]: C9.1 J28.P$2 R14.2 U9.P$1(!SHDN) U9.P$2(IN)
VCC [supply]: J27.P$1 R12.1 R13.1 SV11.2 SV12.2 SV13.3 SV13.7 ; also sheet 1,2,3,4
Unconnected: SV12.3 SV12.5 SV13.4 SV13.6

### Notes on the sheet
- JOYSTICK
- MIC
- For Pushbuttons
- For ftdi chip
- PB1
- PB2
- from ftdi5v to board 5v
- regulator 3.3 to 5v

## Library data of the parts
3V3 5V LED1-LED7 LED18 = led:LED: LED OSRAM: - CHIPLED LG R971, LG N971, LY N971, LG Q971, LY Q971, LO R971, LY R971 LH N974, LH R974 LS Q976, LO Q976, LY Q976 LO Q996 - Hyper CHIPLED LW Q18S LB Q993, LB Q99A, LB R99A - SideLED LS A670, LO A670, LY A670, LG A670, LP A670 LB A673, LV A673, LT A673, LW A673 LH A674 LY A675 LS A676, LA A676, LO A676, LY A676, LW A676 LS A679, LY A679, LG A679 - Hyper Micro SIDELED® LS Y876, LA Y876, LO Y876, LY Y876 LT Y87S - SmartLED LW L88C, LW L88S LB L89C, LB L89S, LG L890 LS L89K, LO L89K, LY L89K LS L896, LA L896, LO L896, LY L896 - TOPLED LS T670, LO T670, LY T670, LG T670, LP T670 LSG T670, LSP T670, LSY T670, LOP T670, LYG T670 LG T671, LOG T671, LSG T671 LB T673, LV T673, LT T673, LW T673 LH T674 LS T676, LA T676, LO T676, LY T676, LB T676, LH T676, LSB T676, LW T676 LB T67C, LV T67C, LT T67C, LS T67K, LO T67K, LY T67K, LW E67C LS E67B, LA E67B, LO E67B, LY E67B, LB E67C, LV E67C, LT E67C LW T67C LS T679, LY T679, LG T679 LS T770, LO T770, LY T770, LG T770, LP T770 LB T773, LV T773, LT T773, LW T773 LH T774 LS E675, LA E675, LY E675, LS T675 LS T776, LA T776, LO T776, LY T776, LB T776 LHGB T686 LT T68C, LB T68C - Hyper Mini TOPLED® LB M676 - Mini TOPLED Santana® LG M470 LS M47K, LO M47K, LY M47K Source: http://www.osram.convergy.de LUXEON: - LUMILED® LXK2-PW12-R00, LXK2-PW12-S00, LXK2-PW14-U00, LXK2-PW14-V00 LXK2-PM12-R00, LXK2-PM12-S00, LXK2-PM14-U00 LXK2-PE12-Q00, LXK2-PE12-R00, LXK2-PE12-S00, LXK2-PE14-T00, LXK2-PE14-U00 LXK2-PB12-K00, LXK2-PB12-L00, LXK2-PB12-M00, LXK2-PB14-N00, LXK2-PB14-P00, LXK2-PB14-Q00 LXK2-PR12-L00, LXK2-PR12-M00, LXK2-PR14-Q00, LXK2-PR14-R00 LXK2-PD12-Q00, LXK2-PD12-R00, LXK2-PD12-S00 LXK2-PH12-R00, LXK2-PH12-S00 LXK2-PL12-P00, LXK2-PL12-Q00, LXK2-PL12-R00 Source: www.luxeon.com KINGBRIGHT: KA-3528ASYC Source: www.kingbright.com
B1 = SE423EagleLibrary:BUZZER
B2 = SE423EagleLibrary:BATTERY_4AA_HOLDER
B3-B5 = custom:BANANA_MALE
C1 C12 C13 C15 C20 C25 C27 C28 = rcl:CPOL-US: POLARIZED CAPACITOR, American symbol
C2-C11 C14 C16-C19 C21-C24 C26 C29 C30 C32-C34 C37 C38 = rcl:C-US: CAPACITOR, American symbol
DCDC3.3V DCDC5V = pinhead:PINHD-1X3: PIN HEADER
G1 = battery:CR2032V: LI BATTERY Varta
IC2 = 74xx-us:74*3384: 10-bit FET bus switches with level shifting
IC3 = 74xx-us:74*04: Hex INVERTER
J1-J4 J6 J23 J24 J123-J132 = strip:STRIP3
J5 = POWER-IN:JACK-PMS
J7-J22 J25-J32 J35-J38 J70-J73 J78-J87 J89-J93 J194 J196-J209 = strip:STRIP2
J88 = SE423EagleLibrary:RELAY_JQC-3F_5V
JP2 JP3 = jumper:JP1E: JUMPER
P1 P2 = custom:TH_PUSHBOTTON
POWER = pinhead:PINHD-1X2: PIN HEADER
Q1 = crystal:CRYTAL: CRYSTAL
QG2 = crystal:XO-: CRYSTAL
R1-R14 R18 R24 R26-R50 = rcl:R-US_: RESISTOR, American symbol
S1 S159 = switch_slide:SWITCH_SLIDE
S2-S19 S21-S23 S25-S28 S129 S130 S137-S139 S141 S147 S167-S189 S210-S226 = custom:STRIP5
S20 S24 S53 S58 = custom:STRIP10
SV1 SV3 SV7 SV8 TRIMPOT1 TRIMPOT2 = con-lstb:MA03-2: PIN HEADER; OC_FARNELL: unknown; OC_NEWARK: unknown
SV2 SV4 = con-lstb:MA20-2: PIN HEADER; OC_FARNELL: unknown; OC_NEWARK: unknown
SV6 SV17 = con-lstb:MA09-2: PIN HEADER; OC_FARNELL: unknown; OC_NEWARK: unknown
SV9 SV10 = con-lstb:MA03-1: PIN HEADER; OC_FARNELL: unknown; OC_NEWARK: unknown
SV11 SV12 = con-lstb:MA05-1: PIN HEADER; OC_FARNELL: unknown; OC_NEWARK: unknown
SV13 = con-lstb:MA04-2: PIN HEADER; OC_FARNELL: unknown; OC_NEWARK: unknown
SV14 SV16 = con-lstb:MA07-2: PIN HEADER
SV15 = con-lstb:MA08-2: PIN HEADER; OC_FARNELL: unknown; OC_NEWARK: unknown
SV23 = con-lstb:MA05-2: PIN HEADER; OC_FARNELL: unknown; OC_NEWARK: unknown
T1 T2 = keres:TIP125: PNP Transistor
U1 U5 = custom:A3953
U2 U4 = SE423EagleLibrary:DRV8874
U3 = custom6:BQ32000
U6 = custom5:MAX4506-SOIC8
U7 U12 = custom2:LS7366R
U8 U11 = custom6:TMS320F28027DAS
U9 = custom4:TL1963A-33KTTR
U$1 = MPU-9250_Breakoutboard:MPU-9250-BB
U$2 U$3 = SE423EagleLibrary:GEARMOTOR_MOUNT
U$4 = SE423EagleLibrary:CASTERWHEEL

## Net classes
0 default: width 0.203 mm, drill 0.508 mm, clearance 0.203 mm
1 supply: width 0.61 mm, drill 0.508 mm, clearance 0.203 mm